# EAGLE design usb2cmi_s3 (EAGLE 6.5.0)
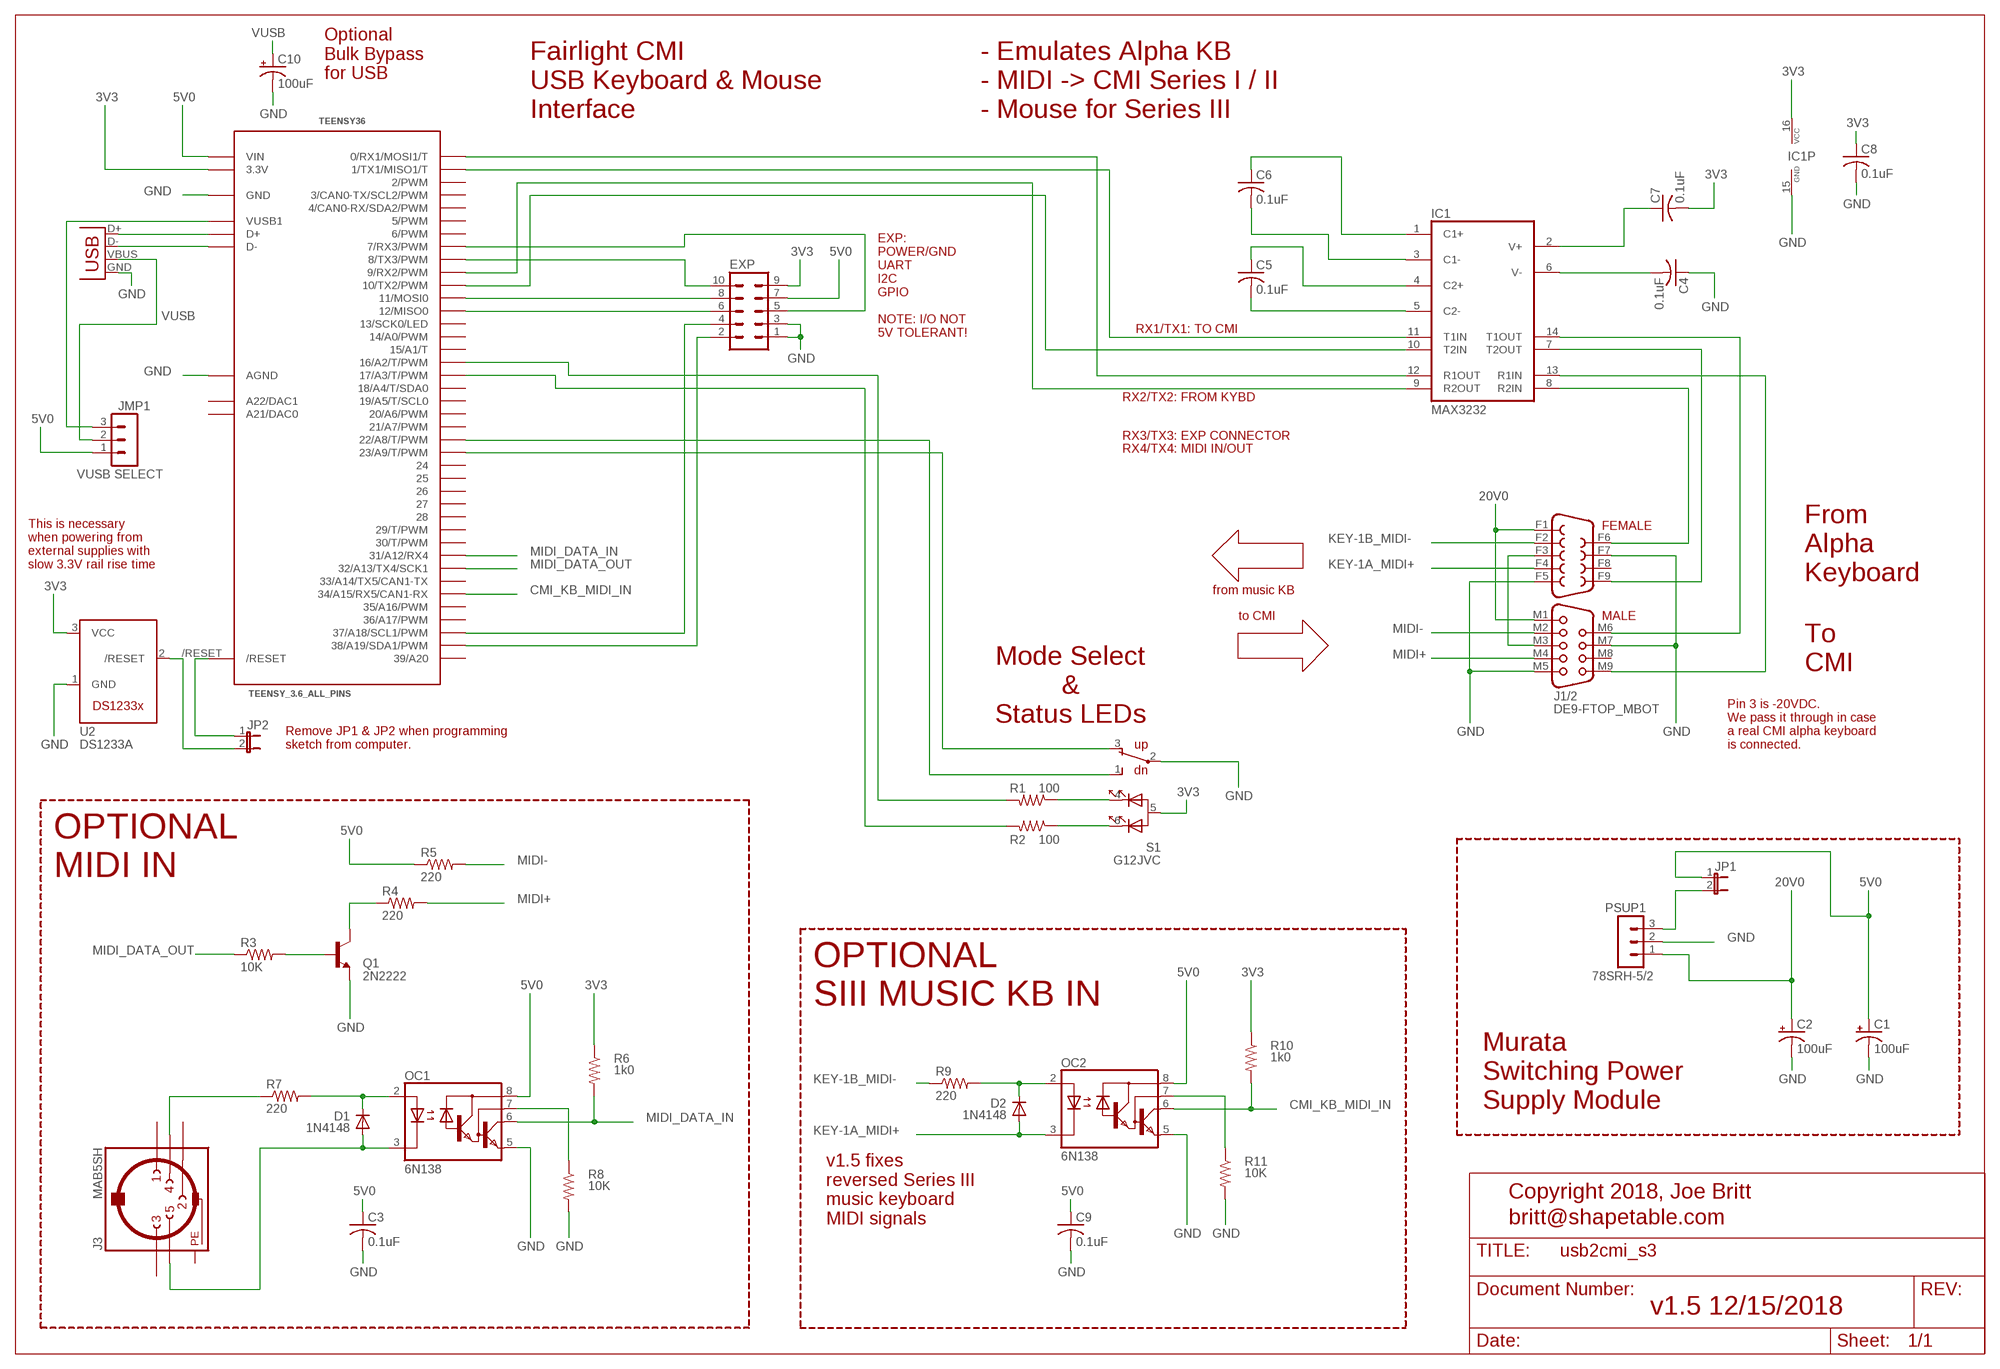
[diagram p0: schematic, sheet 1]

## Parts
C1  100uF  CPOL-USE2.5-7  [E2,5-7]
C2  100uF  CPOL-USE3.5-10  [E3,5-10]
C3  0.1uF  C-US050-025X075  [C050-025X075]
C4  0.1uF  C-US050-025X075  [C050-025X075]
C5  0.1uF  C-US050-025X075  [C050-025X075]
C6  0.1uF  C-US050-025X075  [C050-025X075]
C7  0.1uF  C-US050-025X075  [C050-025X075]
C8  0.1uF  C-US050-025X075  [C050-025X075]
C9  0.1uF  C-US050-025X075  [C050-025X075]
C10  100uF  CPOL-USE2.5-7  [E2,5-7]
D1  1N4148  1N4148DO35-7  [DO35-7]
D2  1N4148  1N4148DO35-7  [DO35-7]
EXP  MA05-2  [MA05-2]
IC1  MAX3232  [DIL16]
J1/2  DE9-FTOP_MBOT  [DE9_FTOP_MBOT]
J3  MAB5SH  [MAB5SH]
J4  USB-A-H  [USB-A-H]
JMP1  VUSB SELECT  MA03-1  [MA03-1]
JP1  JP1E  [JP1]
JP2  JP1E  [JP1]
OC1  6N138  6N138SMALLPADS  [DIL08-NARROW]
OC2  6N138  6N138SMALLPADS  [DIL08-NARROW]
PSUP1  78SRH-5/2  MA03-1  [MA03-1]
Q1  2N2222  [TO92-EBC-OVAL]
R1  100  R-US_0207/10  [0207/10]
R2  100  R-US_0207/10  [0207/10]
R3  10K  R-US_0207/10  [0207/10]
R4  220  R-US_0207/10  [0207/10]
R5  220  R-US_0207/10  [0207/10]
R6  1k0  R-US_0207/10  [0207/10]
R7  220  R-US_0207/10  [0207/10]
R8  10K  R-US_0207/10  [0207/10]
R9  220  R-US_0207/10  [0207/10]
R10  1k0  R-US_0207/10  [0207/10]
R11  10K  R-US_0207/10  [0207/10]
S1  G12JVC  [G12JVC]
TEENSY36  TEENSY_3.6_ALL_PINS  [TEENSY_3.6_ALL_PINS]
U2  DS1233A  DS1233X  [TO-92-]

## Nets
3V3: C7.2 C8.1 EXP.9 IC1.16(VCC) R6.1 R10.1 S1.5(A) TEENSY36.3.3V TEENSY36.3.3V3(3.3V) U2.3(VCC)
5V0: C1.+ C3.1 C9.1 EXP.7 JMP1.1 JP1.1 OC1.8(VCC) OC2.8(VCC) R5.1 TEENSY36.VIN
20V0: C2.+ J1/2.F1 J1/2.M1 PSUP1.1
CMI_KB_MIDI_IN: OC2.6(VO) R10.2 TEENSY36.34/A15(34/A15/RX5/CAN1-RX)
GND: C1.- C2.- C3.2 C4.1 C8.2 C9.2 C10.- EXP.1 EXP.3 IC1.15(GND) J1/2.F5 J1/2.F7 J1/2.M5 J1/2.M7 J4.GND OC1.5(GND) OC2.5(GND) PSUP1.2 Q1.E R8.2 R11.2 S1.2(COM) TEENSY36.AGND TEENSY36.GND TEENSY36.GND1(GND) TEENSY36.GND3(GND) TEENSY36.GND4(GND) U2.1(GND)
KEY-1A_MIDI+: D2.A J1/2.F4 OC2.3(C)
KEY-1B_MIDI-: J1/2.F2 R9.1
MIDI+: J1/2.M4 R4.2
MIDI-: J1/2.M2 R5.2
MIDI_DATA_IN: OC1.6(VO) R6.2 TEENSY36.31/A12(31/A12/RX4)
MIDI_DATA_OUT: R3.1 TEENSY36.32/A13(32/A13/TX4/SCK1)
N$1: JP2.1 TEENSY36./RESET
N$2: JP2.2 U2.2(/RESET)
N$3: EXP.5 TEENSY36.7(7/RX3/PWM)
N$4: EXP.10 TEENSY36.8(8/TX3/PWM)
N$5: EXP.8 TEENSY36.11(11/MOSI0)
N$6: EXP.6 TEENSY36.12(12/MISO0)
N$7: IC1.9(R2OUT) TEENSY36.9(9/RX2/PWM)
N$8: R1.1 S1.4(K_RED)
N$9: R2.1 S1.6(K_GRN)
N$10: R2.2 TEENSY36.17/A3(17/A3/T/PWM)
N$11: R1.2 TEENSY36.16/A2(16/A2/T/PWM)
N$12: S1.1(DOWN) TEENSY36.22/A8(22/A8/T/PWM)
N$13: S1.3(UP) TEENSY36.23/A9(23/A9/T/PWM)
N$14: J4.D+ TEENSY36.D+
N$15: J4.D- TEENSY36.D-
N$16: JMP1.3 TEENSY36.VUSB1
N$17: C5.2 IC1.5(C2-)
N$18: C5.1 IC1.4(C2+)
N$19: C6.2 IC1.3(C1-)
N$20: C6.1 IC1.1(C1+)
N$21: C4.2 IC1.6(V-)
N$22: IC1.11(T1IN) TEENSY36.1(1/TX1/MISO1/T)
N$23: Q1.B R3.2
N$24: IC1.14(T1OUT) J1/2.M6
N$25: C7.1 IC1.2(V+)
N$26: D1.C OC1.2(A) R7.2
N$27: D1.A J3.5 OC1.3(C)
N$28: Q1.C R4.1
N$29: J3.4 R7.1
N$30: IC1.13(R1IN) J1/2.M9
N$31: IC1.12(R1OUT) TEENSY36.0(0/RX1/MOSI1/T)
N$33: IC1.10(T2IN) TEENSY36.10(10/TX2/PWM)
N$34: IC1.8(R2IN) J1/2.F6
N$35: IC1.7(T2OUT) J1/2.F9
N$36: J1/2.F3 J1/2.M3
N$37: OC1.7(VB) R8.1
N$38: JP1.2 PSUP1.3
N$39: D2.C OC2.2(A) R9.2
N$42: OC2.7(VB) R11.1
SCL1: EXP.4 TEENSY36.37/A18(37/A18/SCL1/PWM)
SDA1: EXP.2 TEENSY36.38/A19(38/A19/SDA1/PWM)
VUSB: C10.+ J4.VBUS JMP1.2
Unconnected: J1/2.F8 J1/2.M8 J3.1 J3.2 J3.3 TEENSY36.2(2/PWM) TEENSY36.3(3/CAN0-TX/SCL2/PWM) TEENSY36.4(4/CAN0-RX/SDA2/PWM) TEENSY36.5(5/PWM) TEENSY36.6(6/PWM) TEENSY36.13(13/SCK0/LED) TEENSY36.14/A0(14/A0/PWM) TEENSY36.15/A1(15/A1/T) TEENSY36.18/A4(18/A4/T/SDA0) TEENSY36.19/A5(19/A5/T/SCL0) TEENSY36.20/A6(20/A6/PWM) TEENSY36.21/A7(21/A7/PWM) TEENSY36.24 TEENSY36.25 TEENSY36.26 TEENSY36.27 TEENSY36.28 TEENSY36.29(29/T/PWM) TEENSY36.30(30/T/PWM) TEENSY36.33/A14(33/A14/TX5/CAN1-TX) TEENSY36.35/A16(35/A16/PWM) TEENSY36.36/A17(36/A17/PWM) TEENSY36.39/A20 TEENSY36.A21(A21/DAC0) TEENSY36.A22(A22/DAC1)

## Notes on the sheet
- Optional
  Bulk Bypass
  for USB
- Fairlight CMI
  USB Keyboard & Mouse
  Interface
- - Emulates Alpha KB
  - MIDI -> CMI Series I / II
  - Mouse for Series III
- RX1/TX1: TO CMI
- EXP:
  POWER/GND
  UART
  I2C
  GPIO
  
  NOTE: I/O NOT
  5V TOLERANT!
- RX2/TX2: FROM KYBD
- RX3/TX3: EXP CONNECTOR
- RX4/TX4: MIDI IN/OUT
- This is necessary
  when powering from
  external supplies with
  slow 3.3V rail rise time
- From
  Alpha
  Keyboard
- from music KB
- to CMI
- To
  CMI
- Mode Select
  &
  Status LEDs
- Remove JP1 & JP2 when programming
  sketch from computer.
- Pin 3 is -20VDC.
  We pass it through in case
  a real CMI alpha keyboard
  is connected.
- OPTIONAL
  MIDI IN
- OPTIONAL
  SIII MUSIC KB IN
- Murata
  Switching Power
  Supply Module
- Copyright 2018, Joe Britt
- v1.5 fixes
  reversed Series III
  music keyboard
  MIDI signals
- britt@shapetable.com
- v1.5 12/15/2018

## Power pins joined to a net without a drawn wire
PE: J3.PE J3.PE@(PE)

## Library data of the parts
C1 C2 C10 = rcl:CPOL-US: POLARIZED CAPACITOR, American symbol
C3-C9 = rcl:C-US: CAPACITOR, American symbol
D1 D2 = diode:1N4148: DIODE high speed (Philips)
EXP = con-lstb:MA05-2: PIN HEADER; OC_FARNELL: unknown; OC_NEWARK: unknown
IC1 = maxim-5:MAX3232: RS232 TRANSEIVER
J1/2 = SparkFun-Connectors:DE9-FTOP_MBOT
J3 = con-hirschmann-joe:MAB5SH: Female CONNECTOR 5 pins 90 deg. with shield, horizontal (DIN 41524); OC_FARNELL: 809883; OC_NEWARK: unknown
J4 = con-usb (1):USB: USB Connectors
JMP1 PSUP1 = con-lstb:MA03-1: PIN HEADER; OC_FARNELL: unknown; OC_NEWARK: unknown
JP1 JP2 = jumper:JP1E: JUMPER
OC1 OC2 = optocoupler_joe:6N138: MOTOROLA OPTO COUPLER
Q1 = adafruit:2N2222: NPN TRANSISTOR Big oval pads
R1-R11 = rcl:R-US_: RESISTOR, American symbol
S1 = switch-nkk:G12JVC
TEENSY36 = Teensy_3_and_LC_Series_Boards_v1.4:TEENSY_3.6_ALL_PINS: All PIN version of the Teensy 3.6.
U2 = maxim_joe:DS1233X

## Board
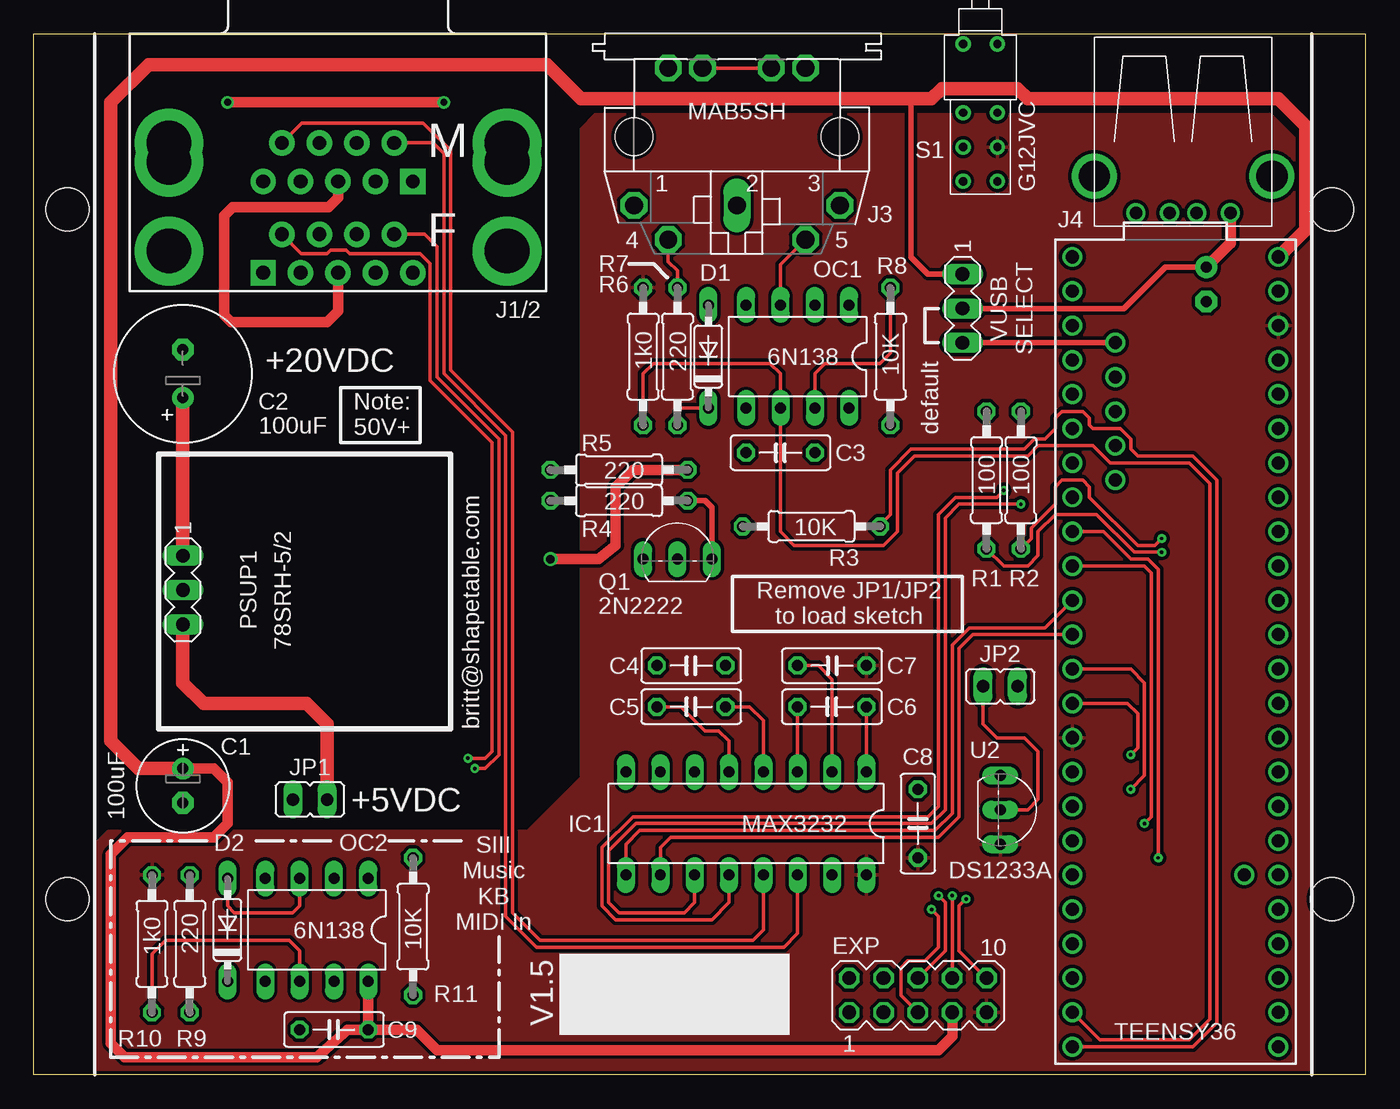
[diagram p1: board, top side]
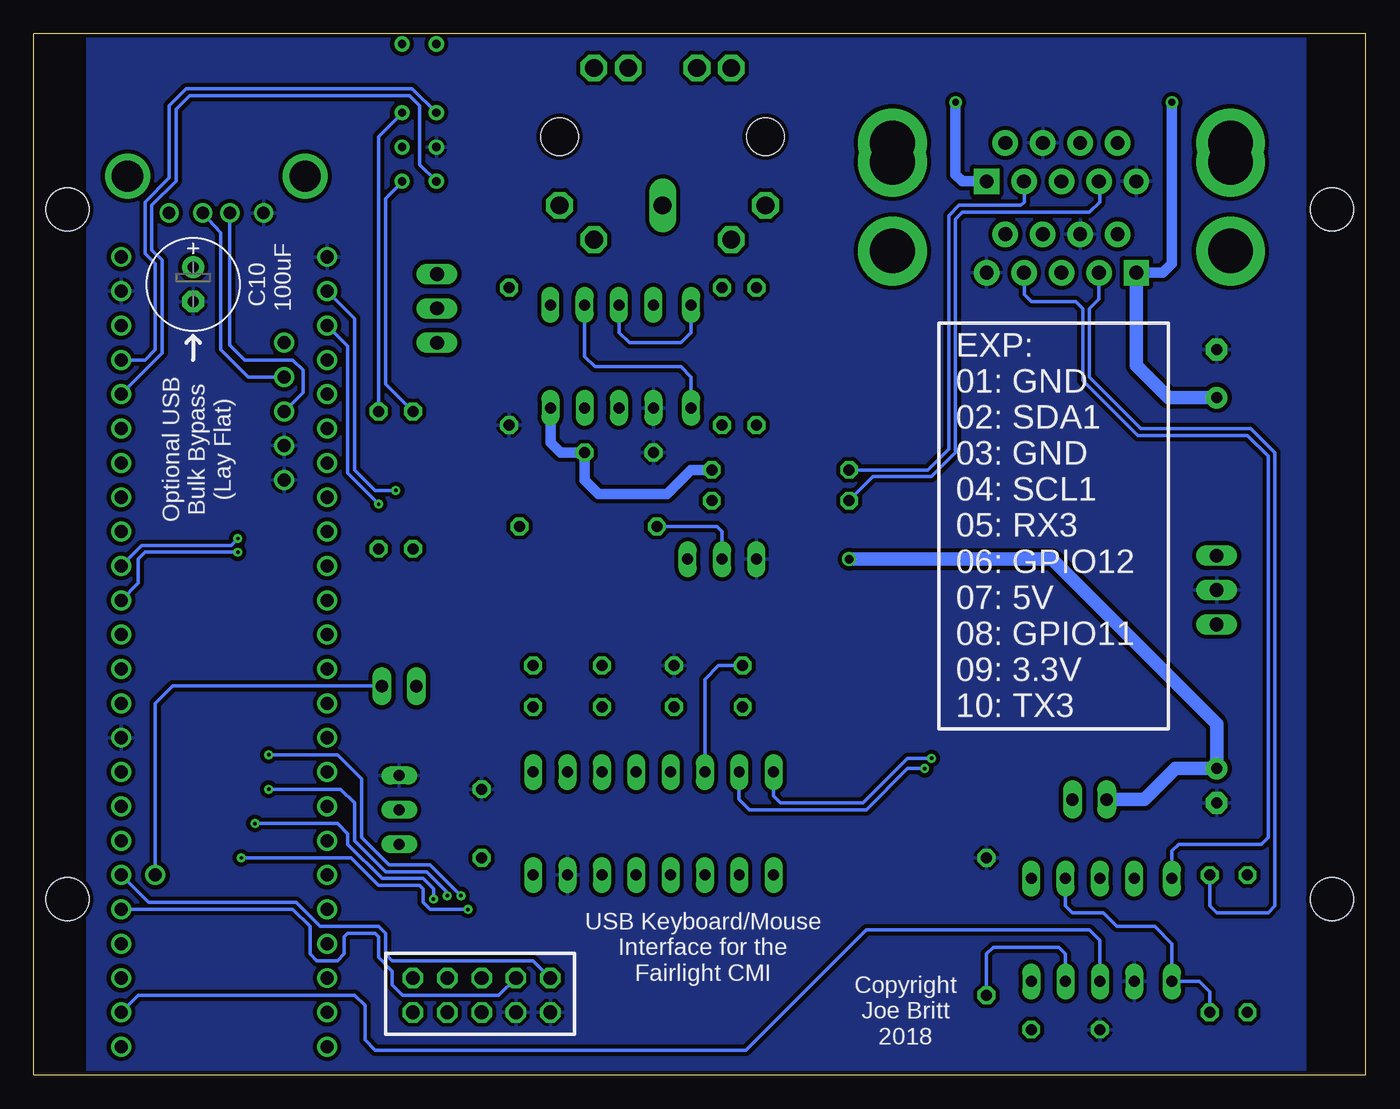
[diagram p2: board, bottom side, seen from below]

Size 98.5 x 77 mm. Coordinates in mm from the lower left corner, seen from the top.
Outline: 98.5,0 0,0 0,77 98.5,77 98.5,0
Copper layers (1*16): Top 0.035mm / dielectric 1.5mm / Bottom 0.035mm
Design rules "default *": minimum track width 6mil, minimum drill 10mil, track to track 6mil, track to pad 6mil, pad to pad 6mil, via to via 6mil, smd to smd 6mil, copper to edge 6mil, drill to drill 6mil, minimum pad ring 10mil, minimum via ring 8mil, stop-mask expansion 4mil, vias tented up to drill 40mil, thermal gap 10mil
Holes 3.2 mm at 2.5,64 96,64 2.5,13 96,13

### Footprints (pad centres in the part's own frame; a part is rotated, then mirrored left to right if it is on the bottom)
E2,5-7 = drill 0.813 pad 1.6: + -1.27,0 | drill 0.813 pad 1.6 octagon: - 1.27,0
E3,5-10 = drill 0.813 pad 1.6: + -1.778,0 | drill 0.813 pad 1.6 octagon: - 1.778,0
C050-025X075 = drill 0.813 octagon: 1 -2.54,0; 2 2.54,0
DO35-7 = drill 0.813 long: A 3.81,0; C -3.81,0
MA05-2 = drill 1.016 octagon: 1 -5.08,-1.27; 2 -5.08,1.27; 3 -2.54,-1.27; 4 -2.54,1.27; 5 0,-1.27; 6 0,1.27; 7 2.54,-1.27; 8 2.54,1.27; 9 5.08,-1.27; 10 5.08,1.27
DIL16 = drill 0.813 long: 1 -8.89,-3.81; 2 -6.35,-3.81; 3 -3.81,-3.81; 4 -1.27,-3.81; 5 1.27,-3.81; 6 3.81,-3.81; 7 6.35,-3.81; 8 8.89,-3.81; 9 8.89,3.81; 10 6.35,3.81; 11 3.81,3.81; 12 1.27,3.81; 13 -1.27,3.81; 14 -3.81,3.81; 15 -6.35,3.81; 16 -8.89,3.81
DE9_FTOP_MBOT = drill 1.016 pad 1.88 square: F1 5.54,17.678; M1 -5.54,10.922 | drill 1.016 pad 1.88: F2 2.77,17.678; F3 0,17.678; F4 -2.77,17.678; F5 -5.54,17.678; F6 4.15,14.834; F7 1.38,14.834; F8 -1.38,14.834; F9 -4.15,14.834; M2 -2.77,10.922; M3 0,10.922; M4 2.77,10.922; M5 5.54,10.922; M6 -4.15,8.077; M7 -1.38,8.077; M8 1.38,8.077; M9 4.15,8.077 | drill 3.302 pad 5.08: G1 12.5,8.077; G2 -12.5,8.077; G3 12.5,16.078; G4 -12.5,16.078; G5 12.5,9.5; G6 -12.5,9.5
MAB5SH = drill 1.321 octagon: 1 7.62,5.08; 3 -7.62,5.08; 4 5.08,7.62; 5 -5.08,7.62; PE -2.54,-5.08; PE1 -5.08,-5.08; PE@ 2.54,-5.08; PE@1 5.08,-5.08 | drill 1.321 long: 2 0,5.08 | hole 2.794: 7.62,0; -7.62,0
USB-A-H = drill 0.914: D+ 2.718,-1.003; D- 2.718,1.003; GND 2.718,-3.493; VBUS 2.718,3.493 | drill 2.311: P$5 0,-6.566; P$6 0,6.566
MA03-1 = drill 1.016 long: 1 -2.54,0; 2 0,0; 3 2.54,0
JP1 = drill 0.914 long: 1 0,-1.27; 2 0,1.27
DIL08-NARROW = drill 0.813 long: 1 -3.81,-3.81; 2 -1.27,-3.81; 3 1.27,-3.81; 4 3.81,-3.81; 5 3.81,3.81; 6 1.27,3.81; 7 -1.27,3.81; 8 -3.81,3.81
TO92-EBC-OVAL = drill 0.813 long: B 0,-1.27; C 2.54,-1.27; E -2.54,-1.27
0207/10 = drill 0.813 octagon: 1 -5.08,0; 2 5.08,0
G12JVC = drill 0.61: 1 1.27,10.16; 2 1.27,7.62; 3 1.27,5.08; 4 -1.27,10.16; 5 -1.27,7.62; 6 -1.27,5.08; LUG1 -1.27,0; LUG2 1.27,0
TEENSY_3.6_ALL_PINS = drill 0.965: 0 -7.62,25.4; 1 -7.62,22.86; 2 -7.62,20.32; 3 -7.62,17.78; 3.3V 7.62,22.86; 3.3V3 -7.62,-7.62; 4 -7.62,15.24; 5 -7.62,12.7; 6 -7.62,10.16; 7 -7.62,7.62; 8 -7.62,5.08; 9 -7.62,2.54; 10 -7.62,0; 11 -7.62,-2.54; 12 -7.62,-5.08; 13 7.62,-5.08; 14/A0 7.62,-2.54; 15/A1 7.62,0; 16/A2 7.62,2.54; 17/A3 7.62,5.08; 18/A4 7.62,7.62; 19/A5 7.62,10.16; 20/A6 7.62,12.7; 21/A7 7.62,15.24; 22/A8 7.62,17.78; 23/A9 7.62,20.32; 24 -7.62,-10.16; 25 -7.62,-12.7; 26 -7.62,-15.24; 27 -7.62,-17.78; 28 -7.62,-20.32; 29 -7.62,-22.86; 30 -7.62,-25.4; 31/A12 -7.62,-27.94; 32/A13 -7.62,-30.48; 33/A14 7.62,-30.48; 34/A15 7.62,-27.94; 35/A16 7.62,-25.4; 36/A17 7.62,-22.86; 37/A18 7.62,-20.32; 38/A19 7.62,-17.78; 39/A20 7.62,-15.24; /RESET 5.08,-17.78; A21 7.62,-12.7; A22 7.62,-10.16; AGND 7.62,25.4; D+ -4.445,16.51; D- -4.445,19.05; GND -7.62,27.94; GND1 7.62,-7.62; GND3 -4.445,13.97; GND4 -4.445,11.43; VIN 7.62,27.94; VUSB1 -4.445,21.59
TO-92- = drill 0.813 long: 1 -2.54,0; 2 0,0; 3 2.54,0

### Placement (x,y rotation side)
C1  11.02,21.38 270 top
C2  11.02,51.86 90 top
C3  55.22,46.02 180 top
C4  48.62,30.27 180 top
C5  48.62,27.23 180 top
C6  59.03,27.23 180 top
C7  59.03,30.27 0 top
C8  65.38,18.59 90 top
C9  22.2,3.35 180 top
C10  86.72,58.47 270 bottom
D1  49.89,53.13 90 top
D2  14.33,10.72 90 top
EXP  65.38,5.89 0 top
IC1  52.68,18.59 180 top
J1/2  22.5,77.01 180 top
J3  52,69.39 180 top
J4  85,66.47 270 top
JMP1  68.68,56.69 270 top
JP1  20.42,20.37 270 top
JP2  71.48,28.75 90 top
OC1  56.49,53.13 180 top
OC2  20.93,10.72 180 top
PSUP1  11.02,35.86 270 top
Q1  47.6,39.42 0 top
R1  70.46,43.99 270 top
R2  73,43.99 270 top
R3  57.51,40.56 180 top
R4  43.28,42.47 180 top
R5  43.28,44.75 180 top
R6  45.06,53.13 270 top
R7  47.6,53.13 270 top
R8  63.35,53.13 270 top
R9  11.53,9.7 270 top
R10  8.74,9.7 270 top
R11  28.04,10.97 90 top
S1  70,76.25 180 top
TEENSY36  84.43,32.56 0 top
U2  71.48,19.61 270 top

### Tracks (layer width: path | path; a pad name or v marks a point on that pad's centre or on a via)
3V3
  pour Top (isolate 0.254): 4.5,0 94.5,0 94.5,68 91.5,71 41.5,71 40.5,70 40.5,22 36.5,18 5.5,18 4.5,17
5V0  (via drill 0.64)
  Top 0.406: JMP1.1 66.14,59.23 64.87,60.5 64.87,72.18
  Top 0.762: EXP.7 67.92,2.84 66.9,1.83 29.82,1.83 28.3,3.35 C9.1 | v38.2,38.15 41.76,38.15 43.03,39.16 43.03,43.48 44.3,44.75 R5.1 | C1.+ 13.31,22.65 14.33,21.64 14.33,18.59 13.31,17.57 6.96,17.57 5.69,16.3 5.69,2.33 6.71,1.32 20.93,1.32 23.22,3.35 C9.1 | OC2.8 C9.1
  Top 1.016: TEENSY36.VIN 94.08,62.53 94.08,70.15 92.05,72.18 73.51,72.18 72.75,72.95 67.16,72.95 66.4,72.18 64.87,72.18 40.49,72.18 37.95,74.72 8.48,74.72 5.69,71.93 5.69,24.69 7.72,22.65 C1.+
  Bottom 0.762: OC1.8 60.3,46.78 59.54,46.02 C3.1 57.76,43.99 56.74,42.97 51.66,42.97 49.89,44.75 R5.1
  Bottom 1.016: v38.2,38.15 23.22,38.15 11.02,25.96 C1.+ 14.07,22.65 16.36,20.37 JP1.1
20V0  (via drill 0.51)
  Top 0.762: v14.33,71.93 v30.33,71.93
  Top 1.016: C2.+ PSUP1.1
  Bottom 0.762: J1/2.M1 29.82,66.09 30.33,66.6 v30.33,71.93 | v14.33,71.93 14.33,59.99 14.99,59.33 J1/2.F1
  Bottom 1.016: C2.+ 14.58,50.09 16.96,52.47 J1/2.F1
CMI_KB_MIDI_IN
  Top 0.254: R10.2 8.74,8.94 9.75,9.95 18.9,9.95 19.66,9.19 OC2.6
  Bottom 0.254: OC2.6 19.66,9.95 20.42,10.72 36.93,10.72 45.82,1.83 73.25,1.83 74.02,2.59 74.02,5.13 74.78,5.89 90.78,5.89 TEENSY36.34/A15
GND
  pour Bottom (isolate 0.305): 4.5,0 4.5,77 94.5,77 94.5,0.03
KEY-1A_MIDI+
  Top 0.254: D2.A 14.33,12.49 14.83,11.99 19.15,11.99 19.66,12.49 OC2.3
  Bottom 0.254: J1/2.F4 25.25,59.31 25.25,57.71 24.74,57.2 21.44,57.2 20.93,56.69 20.93,51.36 16.87,47.29 8.74,47.29 7.21,45.77 7.21,17.57 7.72,17.07 13.82,17.07 14.33,16.56 D2.A
KEY-1B_MIDI-
  Bottom 0.254: J1/2.F2 19.73,57.38 20.42,56.69 20.42,51.61 16.61,47.8 8.48,47.8 6.71,46.02 6.71,12.49 7.21,11.99 11.02,11.99 11.53,12.49 R9.1
MIDI+
  Bottom 0.254: R4.2 36.42,44.24 32.11,44.24 30.33,46.02 30.33,63.29 29.82,63.8 20.42,63.8 19.66,64.56 19.66,66.02 J1/2.M4
MIDI-
  Bottom 0.254: R5.2 32.36,44.75 30.84,46.28 30.84,63.55 30.07,64.31 25.5,64.31 25.25,64.56 25.25,66.07 J1/2.M2
MIDI_DATA_IN
  Top 0.254: R6.2 45.06,51.86 45.82,52.63 54.46,52.63 55.22,51.86 OC1.6 55.22,40.18 56.24,39.16 62.84,39.16 63.86,40.18 63.86,44.5 65.13,45.77 73.51,45.77 74.27,46.53 78.33,46.53 79.6,45.26 85.45,45.26 86.97,43.74 86.97,4.11 85.45,2.59 78.84,2.59 TEENSY36.31/A12
MIDI_DATA_OUT
  Top 0.254: TEENSY36.32/A13 85.7,2.08 87.48,3.86 87.48,43.99 85.7,45.77 81.64,45.77 81.13,46.28 81.13,47.04 80.37,47.8 78.33,47.8 78.08,48.05 78.08,48.56 77.57,49.07 76.05,49.07 75.54,48.56 75.54,47.8 74.78,47.04 74.02,47.04 73.25,46.28 64.87,46.28 63.35,44.75 63.35,41.45 62.71,40.81 R3.1
N$1
  Bottom 0.254: JP2.1 88.24,28.75 89.51,27.48 TEENSY36./RESET
N$2
  Top 0.254: U2.2 73.51,19.61 74.27,20.37 74.27,23.92 73.25,24.94 71.22,24.94 70.21,25.96 JP2.2
N$3  (via drill 0.25)
  Top 0.254: TEENSY36.7 79.1,40.18 81.13,38.15 82.4,38.15 83.16,37.39 v83.16,16.05 | v66.4,12.24 66.9,11.73 66.9,9.45 65.89,8.43 64.62,8.43 64.11,7.92 64.11,5.89 EXP.5
  Bottom 0.254: v83.16,16.05 75.03,16.05 73,14.02 69.95,14.02 69.7,13.76 69.7,12.75 69.19,12.24 v66.4,12.24
N$4  (via drill 0.25)
  Top 0.254: EXP.10 68.43,9.19 68.43,12.49 v68.94,13 | v82.14,18.59 82.65,19.1 82.65,37.13 82.14,37.64 TEENSY36.8
  Bottom 0.254: v68.94,13 68.94,13.76 69.7,14.53 72.75,14.53 75.29,17.07 75.29,17.83 76.05,18.59 v82.14,18.59
N$5  (via drill 0.25)
  Top 0.254: EXP.8 v67.92,13.26 | v81.13,21.13 82.14,22.15 82.14,29 81.13,30.02 TEENSY36.11
  Bottom 0.254: v67.92,13.26 67.92,13.51 69.44,15.03 72.49,15.03 74.78,17.32 74.78,20.11 75.79,21.13 v81.13,21.13
N$6  (via drill 0.25)
  Top 0.254: EXP.6 67.41,9.19 67.41,12.75 v66.9,13.26 | v81.13,23.67 81.64,24.18 81.64,26.72 80.87,27.48 TEENSY36.12
  Bottom 0.254: v66.9,13.26 69.19,15.54 72.24,15.54 74.27,17.57 74.27,21.89 76.05,23.67 v81.13,23.67
N$7
  Top 0.254: IC1.9 43.79,17.07 44.81,18.08 66.65,18.08 67.92,19.35 67.92,31.8 69.19,33.07 74.78,33.07 TEENSY36.9
N$8
  Bottom 0.254: R1.1 72.49,51.1 72.49,64.82 71.27,66.04 S1.4
N$9
  Bottom 0.254: R2.1 73,69.39 71.27,71.12 S1.6
N$10  (via drill 0.25)
  Top 0.254: R2.2 73.76,39.67 73.76,40.43 75.54,42.21 75.54,43.48 76.05,43.99 77.57,43.99 78.08,43.48 78.08,42.72 81.64,39.16 82.91,39.16 v83.41,39.67
  Bottom 0.254: v83.41,39.67 83.92,39.16 90.53,39.16 TEENSY36.17/A3
N$11  (via drill 0.25)
  Top 0.254: R1.2 71.73,37.64 73.51,37.64 74.27,38.4 74.27,40.18 75.54,41.45 78.59,41.45 81.38,38.66 v83.41,38.66
  Bottom 0.254: v83.41,38.66 90.27,38.66 90.78,38.15 90.78,36.37 TEENSY36.16/A2
N$12
  Bottom 0.254: TEENSY36.22/A8 89,53.39 89,60.25 89.76,61.01 89.76,64.31 87.99,66.09 87.99,71.42 86.97,72.44 70.71,72.44 69.95,71.68 69.95,67.31 S1.1
N$13
  Bottom 0.254: TEENSY36.23/A9 90.27,52.88 89.51,53.64 89.51,59.99 90.27,60.75 90.27,64.56 88.49,66.34 88.49,71.68 87.22,72.95 70.51,72.95 S1.3
N$14
  Bottom 0.254: TEENSY36.D+ 78.59,50.47 78.59,52.12 79.35,52.88 82.91,52.88 84,53.97 J4.D+
N$15
  Bottom 0.254: TEENSY36.D- 82.65,51.61 84.68,53.64 84.68,62.3 J4.D-
N$16
  Top 0.406: JMP1.3 TEENSY36.VUSB1
N$17
  Top 0.254: C5.2 47.85,27.23 49.63,25.45 50.65,25.45 51.41,24.69 IC1.5
N$18
  Top 0.254: C5.1 52.93,27.23 53.95,26.21 IC1.4
N$19
  Top 0.254: C6.2 IC1.3
N$20
  Top 0.254: C6.1 IC1.1
N$21
  Bottom 0.254: C4.2 47.85,30.27 48.87,29.26 IC1.6
N$22  (via drill 0.25)
  Top 0.254: IC1.11 48.87,12.75 48.11,11.99 43.28,11.99 42.52,12.75 42.52,16.56 44.55,18.59 66.4,18.59 67.41,19.61 67.41,41.2 68.43,42.21 v73,42.21
  Bottom 0.254: v73,42.21 75.29,44.5 75.29,53.9 TEENSY36.1
N$23
  Bottom 0.254: R3.2 47.98,40.56 47.6,40.18 Q1.B
N$24
  Top 0.254: J1/2.M6 29.52,68.93 30.33,68.12 30.33,51.86 34.9,47.29 34.9,11.73 37.19,9.45 55.47,9.45 56.49,10.46 IC1.14
N$25
  Top 0.254: C7.1 58.01,30.27 59.03,29.26 IC1.2
N$26
  Top 0.254: R7.2 47.6,49.07 47.85,49.32 D1.C
  Bottom 0.254: D1.C 49.89,51.61 50.65,52.37 57,52.37 57.76,53.13 OC1.2
N$27
  Top 0.254: OC1.3 55.22,59.91 J3.5
  Bottom 0.254: D1.A 49.89,54.91 50.65,54.15 54.46,54.15 55.22,54.91 OC1.3
N$28
  Top 0.406: R4.1 49.63,42.47 50.14,41.96 Q1.C
N$29
  Top 0.254: J3.4 46.92,60.16 47.6,59.48 R7.1
N$30
  Top 0.254: IC1.13 53.95,10.72 53.19,9.95 37.44,9.95 35.41,11.99 35.41,47.55 30.84,52.12 30.84,68.37 28.8,70.41 19.82,70.41 J1/2.M9
N$31  (via drill 0.25)
  Top 0.254: IC1.12 51.41,12.75 50.14,11.48 43.03,11.48 42.01,12.49 42.01,16.81 44.3,19.1 66.14,19.1 66.9,19.86 66.9,41.45 68.17,42.72 71.22,42.72 v71.73,43.23
  Bottom 0.254: v71.73,43.23 73.25,43.23 74.78,44.75 74.78,55.93 TEENSY36.0
N$33
  Top 0.254: IC1.10 46.33,16.81 47.09,17.57 66.9,17.57 68.43,19.1 68.43,31.54 69.44,32.56 TEENSY36.10
N$34  (via drill 0.25)
  Top 0.254: v32.11,23.42 33.38,23.42 33.88,23.92 33.88,46.78 29.31,51.36 29.31,59.99 28.55,60.75 23.34,60.75 23.09,61.01 21.95,61.01 21.69,60.75 19.77,60.75 J1/2.F6
  Bottom 0.254: v32.11,23.42 33.88,23.42 37.19,20.11 43.28,20.11 43.79,20.62 IC1.8
N$35  (via drill 0.25)
  Top 0.254: J1/2.F9 28.91,62.18 29.82,61.26 29.82,51.61 34.39,47.04 34.39,23.67 33.38,22.65 v32.61,22.65
  Bottom 0.254: v32.61,22.65 33.88,22.65 36.93,19.61 45.57,19.61 46.33,20.37 IC1.7
N$36
  Top 0.762: J1/2.M3 22.5,64.86 21.82,64.18 14.71,64.18 14.07,63.55 14.07,56.18 14.58,55.67 21.69,55.67 22.5,56.48 J1/2.F3
N$37
  Top 0.254: OC1.7 57.76,51.86 58.52,52.63 62.59,52.63 63.35,53.39 R8.1
N$38
  Top 1.016: PSUP1.3 11.02,29 12.55,27.48 20.17,27.48 21.69,25.96 JP1.2
N$39
  Bottom 0.254: R9.2 11.53,6.14 12.29,6.91 D2.C 14.33,9.7 15.6,10.97 18.39,10.97 19.41,11.99 21.69,11.99 22.2,12.49 OC2.2
N$42
  Bottom 0.254: OC2.7 22.2,8.94 22.71,9.45 27.53,9.45 28.04,8.94 R11.1
PE
  Top 0.254: J3.PE@ J3.PE
SCL1
  Bottom 0.254: EXP.4 64.11,5.89 71.22,5.89 71.98,6.65 71.98,7.67 73,8.68 73,10.21 73.25,10.46 75.29,10.46 75.54,10.21 75.54,8.94 76.05,8.43 77.57,8.43 78.08,8.94 78.08,10.97 79.35,12.24 TEENSY36.37/A18
SDA1
  Bottom 0.254: EXP.2 61.57,8.43 71.98,8.43 72.49,8.94 72.49,10.46 73,10.97 77.32,10.97 79.1,12.75 90.02,12.75 TEENSY36.38/A19
VUSB
  Top 0.406: JMP1.2 80.62,56.69 83.67,59.74 C10.+
  Top 0.813: J4.VBUS 88.49,61.51 C10.+

### Text on the board
tPlace: VUSB / SELECT | +20VDC | default | Note: / 50V+ | Remove JP1/JP2 / to load sketch | britt@shapetable.com | +5VDC | SIII / Music / KB / MIDI In | V1.5
bPlace: Optional USB / Bulk Bypass / (Lay Flat) | EXP: / 01: GND / 02: SDA1 / 03: GND / 04: SCL1 / 05: RX3 / 06: GPIO12 / 07: 5V / 08: GPIO11 / 09: 3.3V / 10: TX3 | USB Keyboard/Mouse / Interface for the / Fairlight CMI | Copyright / Joe Britt / 2018
Measures: 24.75mm | 87.25mm | 54.25mm | 72.25mm | 85mm | 70mm | 52mm | outer edge | 2.25mm | 22.5mm